# Altium schematic sheet 601_GridPos6.SchDoc
size A2; Organization: Greenfield Tech Solutions; Address1: Molendreef 33; Address2: Ossendrecht; Address3: 4641CS; Address4: The Netherlands; SheetNumber: 6; SheetTotal: 7
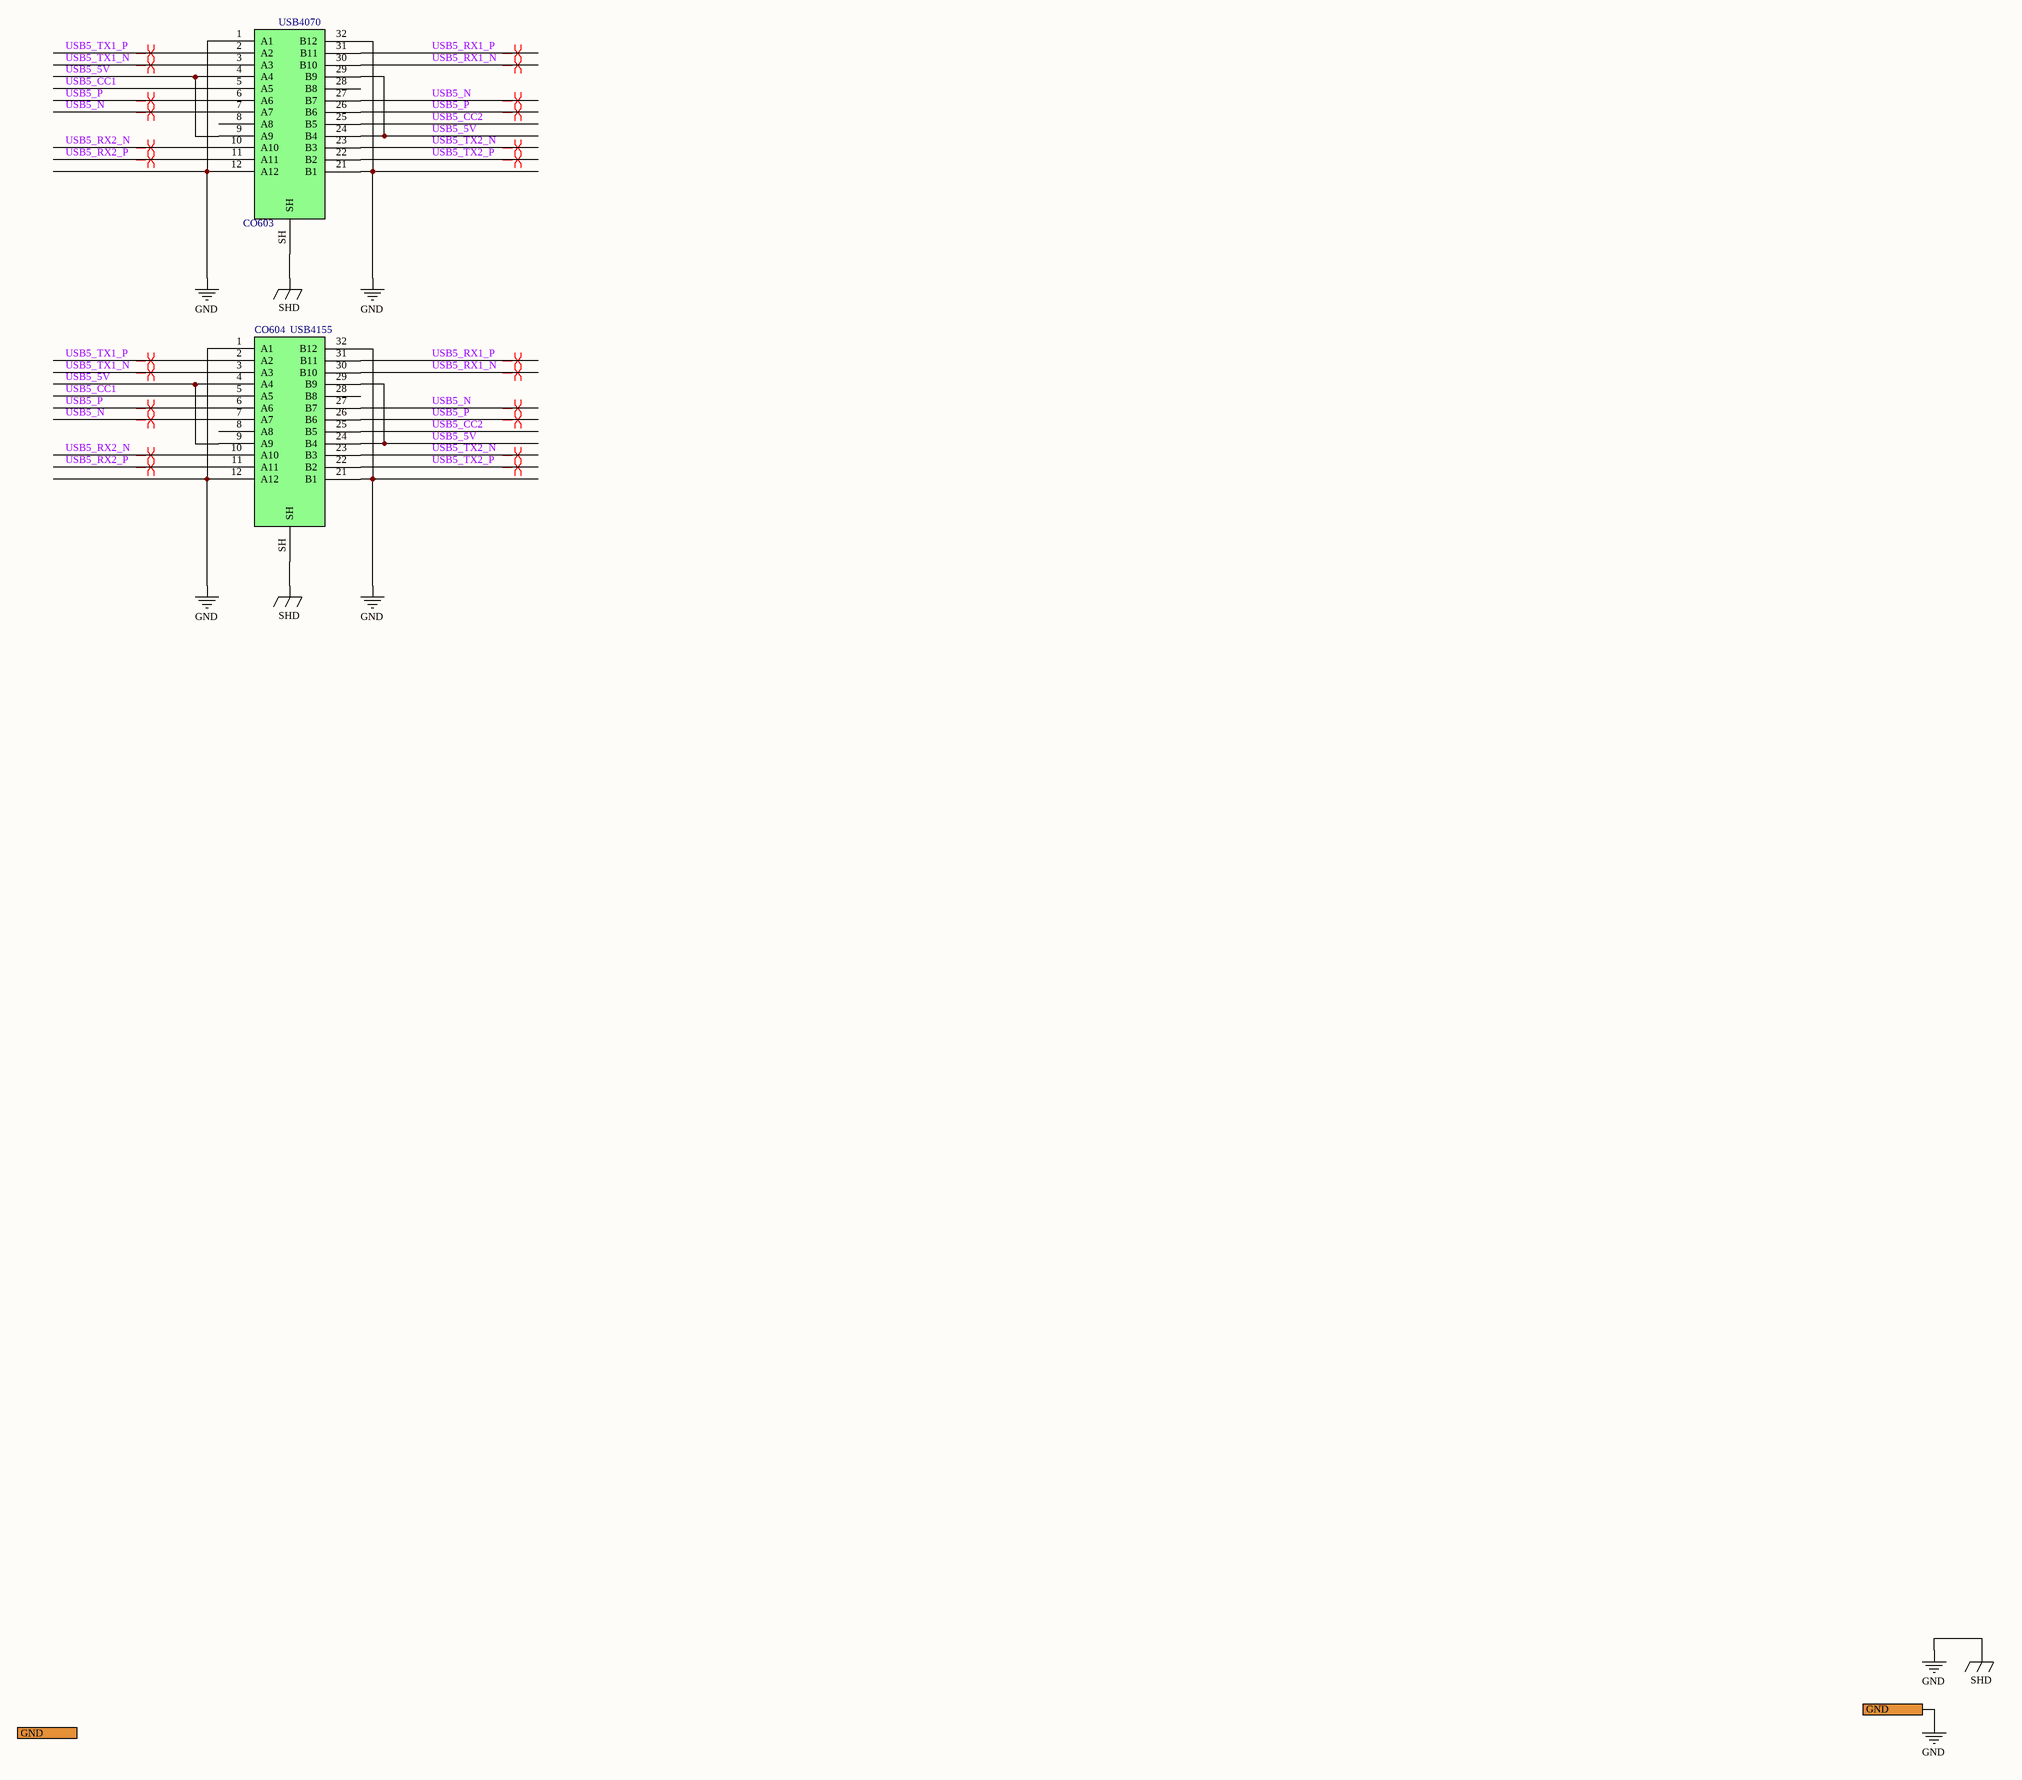
[diagram p0: 601_GridPos6.SchDoc]

## Parts
CO603  USB4070  [USB4070-30-C]
CO604  USB4155  [USB4155-03-C]

## Ports
GND

## Nets
GND: CO603.1(A1) CO603.12(A12) CO603.21(B1) CO603.32(B12) CO603.SH CO604.1(A1) CO604.12(A12) CO604.21(B1) CO604.32(B12) CO604.SH ; port GND  [also labelled SHD]
USB5_5V: CO603.4(A4) CO603.9(A9) CO603.24(B4) CO603.29(B9) CO604.4(A4) CO604.9(A9) CO604.24(B4) CO604.29(B9)
USB5_CC1: CO603.5(A5) CO604.5(A5)
USB5_CC2: CO603.25(B5) CO604.25(B5)
USB5_N: CO603.7(A7) CO603.27(B7) CO604.7(A7) CO604.27(B7)
USB5_P: CO603.6(A6) CO603.26(B6) CO604.6(A6) CO604.26(B6)
USB5_RX1_N: CO603.30(B10) CO604.30(B10)
USB5_RX1_P: CO603.31(B11) CO604.31(B11)
USB5_RX2_N: CO603.10(A10) CO604.10(A10)
USB5_RX2_P: CO603.11(A11) CO604.11(A11)
USB5_TX1_N: CO603.3(A3) CO604.3(A3)
USB5_TX1_P: CO603.2(A2) CO604.2(A2)
USB5_TX2_N: CO603.23(B3) CO604.23(B3)
USB5_TX2_P: CO603.22(B2) CO604.22(B2)

Not connected (* = marked no-connect by the designer): CO603 8(A8) 28(B8); CO604 8(A8) 28(B8)

## Layout directives
differential pair; differential pair class USB3: USB5_N, USB5_P, USB5_RX1_N, USB5_RX1_P, USB5_RX2_N, USB5_RX2_P, USB5_TX1_N, USB5_TX1_P, USB5_TX2_N, USB5_TX2_P

## Notes on the sheet
- Title
- Size:
- Date:
- File:
- A2
- Number:
- Time:
- Revision:
- Sheet
- of

## Library data of the parts
CO603 = CO0021: USB C connector Receptacle Vertical; Part Number: CO0021; ID: 16; RefVal: USB4070; ManfactPart: USB4070-30-C
CO604 = CO0031: USB C connector Plug Horizontal; Part Number: CO0031; ID: 30; RefVal: USB4155; ManfactPart: USB4155-03-C